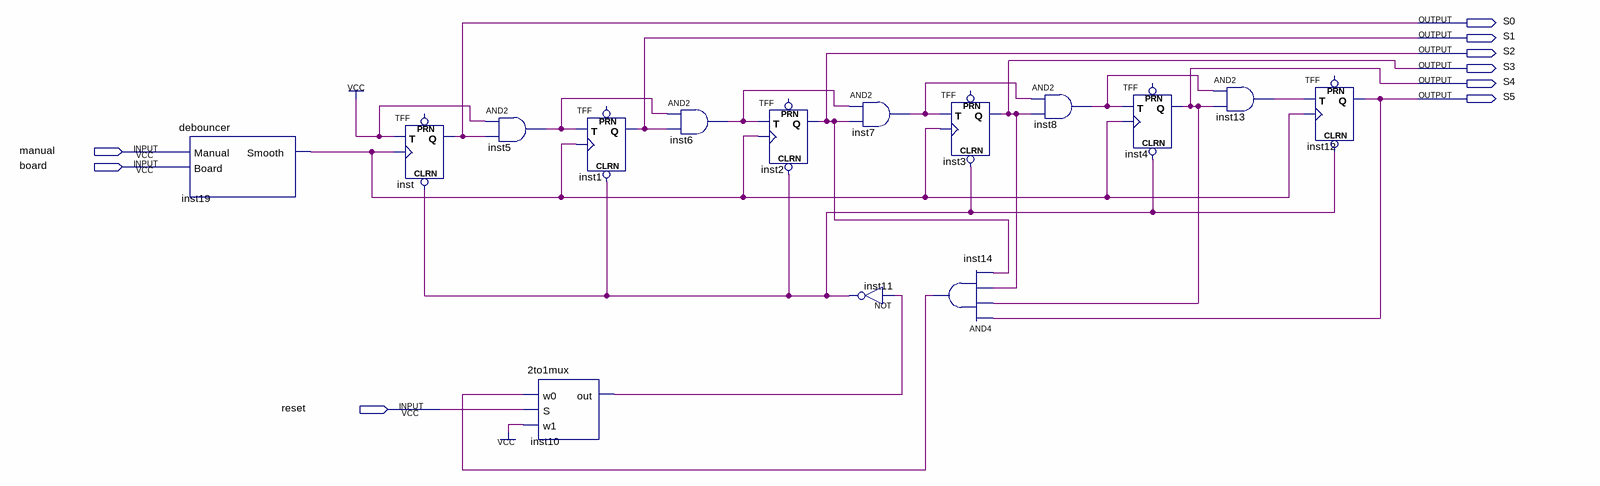
[diagram p0: schematic sheet]
// Quartus schematic 60count.bdf as structural Verilog: 15 symbols, 9 pins
module \60count  (
  input  manual,
  input  board,
  input  reset,
  output S0,
  output S1,
  output S2,
  output S3,
  output S4,
  output S5
);

  wire inst5_out, inst6_out, inst7_out, inst8_out, inst10_out, inst11_out, inst13_out, inst14_out,
       inst19_smooth;

  debouncer inst19 (.Manual(manual), .Board(board), .Smooth(inst19_smooth));
  TFF inst (.CLRN(inst11_out), .T(1'b1), .CLK(inst19_smooth), .Q(S0));  // open: PRN
  and inst5 (inst5_out, 1'b1, S0);
  \2to1mux  inst10 (.w0(inst14_out), .S(reset), .w1(1'b1), .out(inst10_out));
  TFF inst1 (.CLRN(inst11_out), .T(inst5_out), .CLK(inst19_smooth), .Q(S1));  // open: PRN
  and inst6 (inst6_out, inst5_out, S1);
  TFF inst2 (.CLRN(inst11_out), .T(inst6_out), .CLK(inst19_smooth), .Q(S2));  // open: PRN
  and inst7 (inst7_out, inst6_out, S2);
  not inst11 (inst11_out, inst10_out);
  TFF inst3 (.CLRN(inst11_out), .T(inst7_out), .CLK(inst19_smooth), .Q(S3));  // open: PRN
  and inst14 (inst14_out, S5, S4, S3, S2);
  and inst8 (inst8_out, inst7_out, S3);
  TFF inst4 (.CLRN(inst11_out), .T(inst8_out), .CLK(inst19_smooth), .Q(S4));  // open: PRN
  and inst13 (inst13_out, inst8_out, S4);
  TFF inst12 (.CLRN(inst11_out), .T(inst13_out), .CLK(inst19_smooth), .Q(S5));  // open: PRN
endmodule
